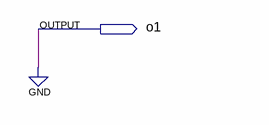
[diagram p0: schematic sheet]
// Quartus schematic gnd_1.bdf as structural Verilog: 0 symbols, 1 pins
module gnd_1 (
  output o1
);


  assign o1 = 1'b0;
endmodule
